# EAGLE schematic 7-segment (EAGLE 7.5.0)
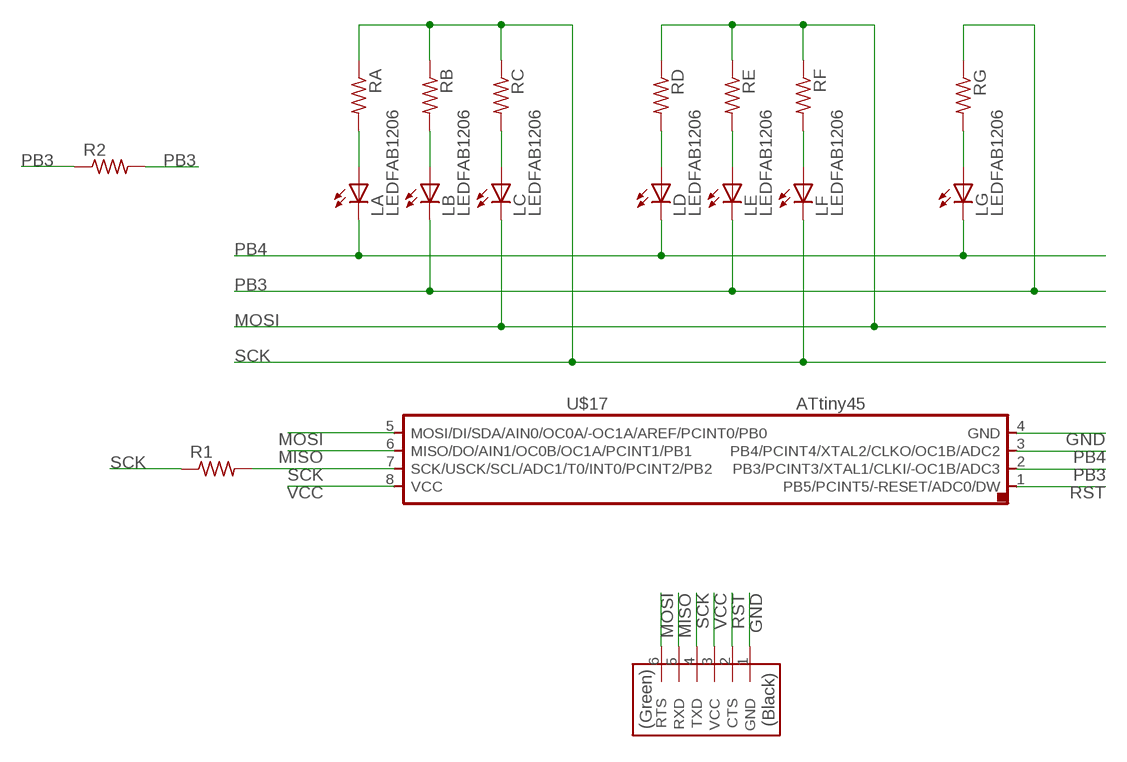
[diagram p0: schematic, sheet 1]

## Parts
LA  LEDFAB1206  [LED1206FAB]
LB  LEDFAB1206  [LED1206FAB]
LC  LEDFAB1206  [LED1206FAB]
LD  LEDFAB1206  [LED1206FAB]
LE  LEDFAB1206  [LED1206FAB]
LF  LEDFAB1206  [LED1206FAB]
LG  LEDFAB1206  [LED1206FAB]
R1  RES-US1206FAB  [R1206FAB]
R2  RES-US1206FAB  [R1206FAB]
RA  RES-US1206FAB  [R1206FAB]
RB  RES-US1206FAB  [R1206FAB]
RC  RES-US1206FAB  [R1206FAB]
RD  RES-US1206FAB  [R1206FAB]
RE  RES-US1206FAB  [R1206FAB]
RF  RES-US1206FAB  [R1206FAB]
RG  RES-US1206FAB  [R1206FAB]
U$3  FTDI-SMD-HEADER  [1X06SMD]
U$17  ATTINY45SI  [SOIC8]

## Nets
GND: U$3.1(GND) U$17.4(GND)
MISO: U$3.5(RXD) U$17.6(MISO/DO/AIN1/OC0B/OC1A/PCINT1/PB1)
MOSI: LC.2(C) RD.1 RE.1 RF.1 U$3.6(RTS) U$17.5(MOSI/DI/SDA/AIN0/OC0A/-OC1A/AREF/PCINT0/PB0)
N$1: LA.1(A) RA.2
N$2: LB.1(A) RB.2
N$3: LC.1(A) RC.2
N$4: LD.1(A) RD.2
N$5: LE.1(A) RE.2
N$6: LF.1(A) RF.2
N$7: LG.1(A) RG.2
PB3: LB.2(C) LE.2(C) R2.1 R2.2 RG.1 U$17.2(PB3/PCINT3/XTAL1/CLKI/-OC1B/ADC3)
PB4: LA.2(C) LD.2(C) LG.2(C) U$17.3(PB4/PCINT4/XTAL2/CLKO/OC1B/ADC2)
RST: U$3.2(CTS) U$17.1(PB5/PCINT5/-RESET/ADC0/DW)
SCK: LF.2(C) R1.1 R1.2 RA.1 RB.1 RC.1 U$3.4(TXD) U$17.7(SCK/USCK/SCL/ADC1/T0/INT0/PCINT2/PB2)
VCC: U$3.3(VCC) U$17.8(VCC)

## Library data of the parts
LA LB LC LD LE LF LG = fab:LED: LED
R1 R2 RA RB RC RD RE RF RG = fab:RES-US: Resistor (US Symbol) Variants with postfix FAB are widened to allow the routing of internal traces
U$3 = fab:FTDI-SMD-HEADER
U$17 = fab:ATTINY45

## Net classes
0 default: width 0.457 mm, clearance 1.626 mm